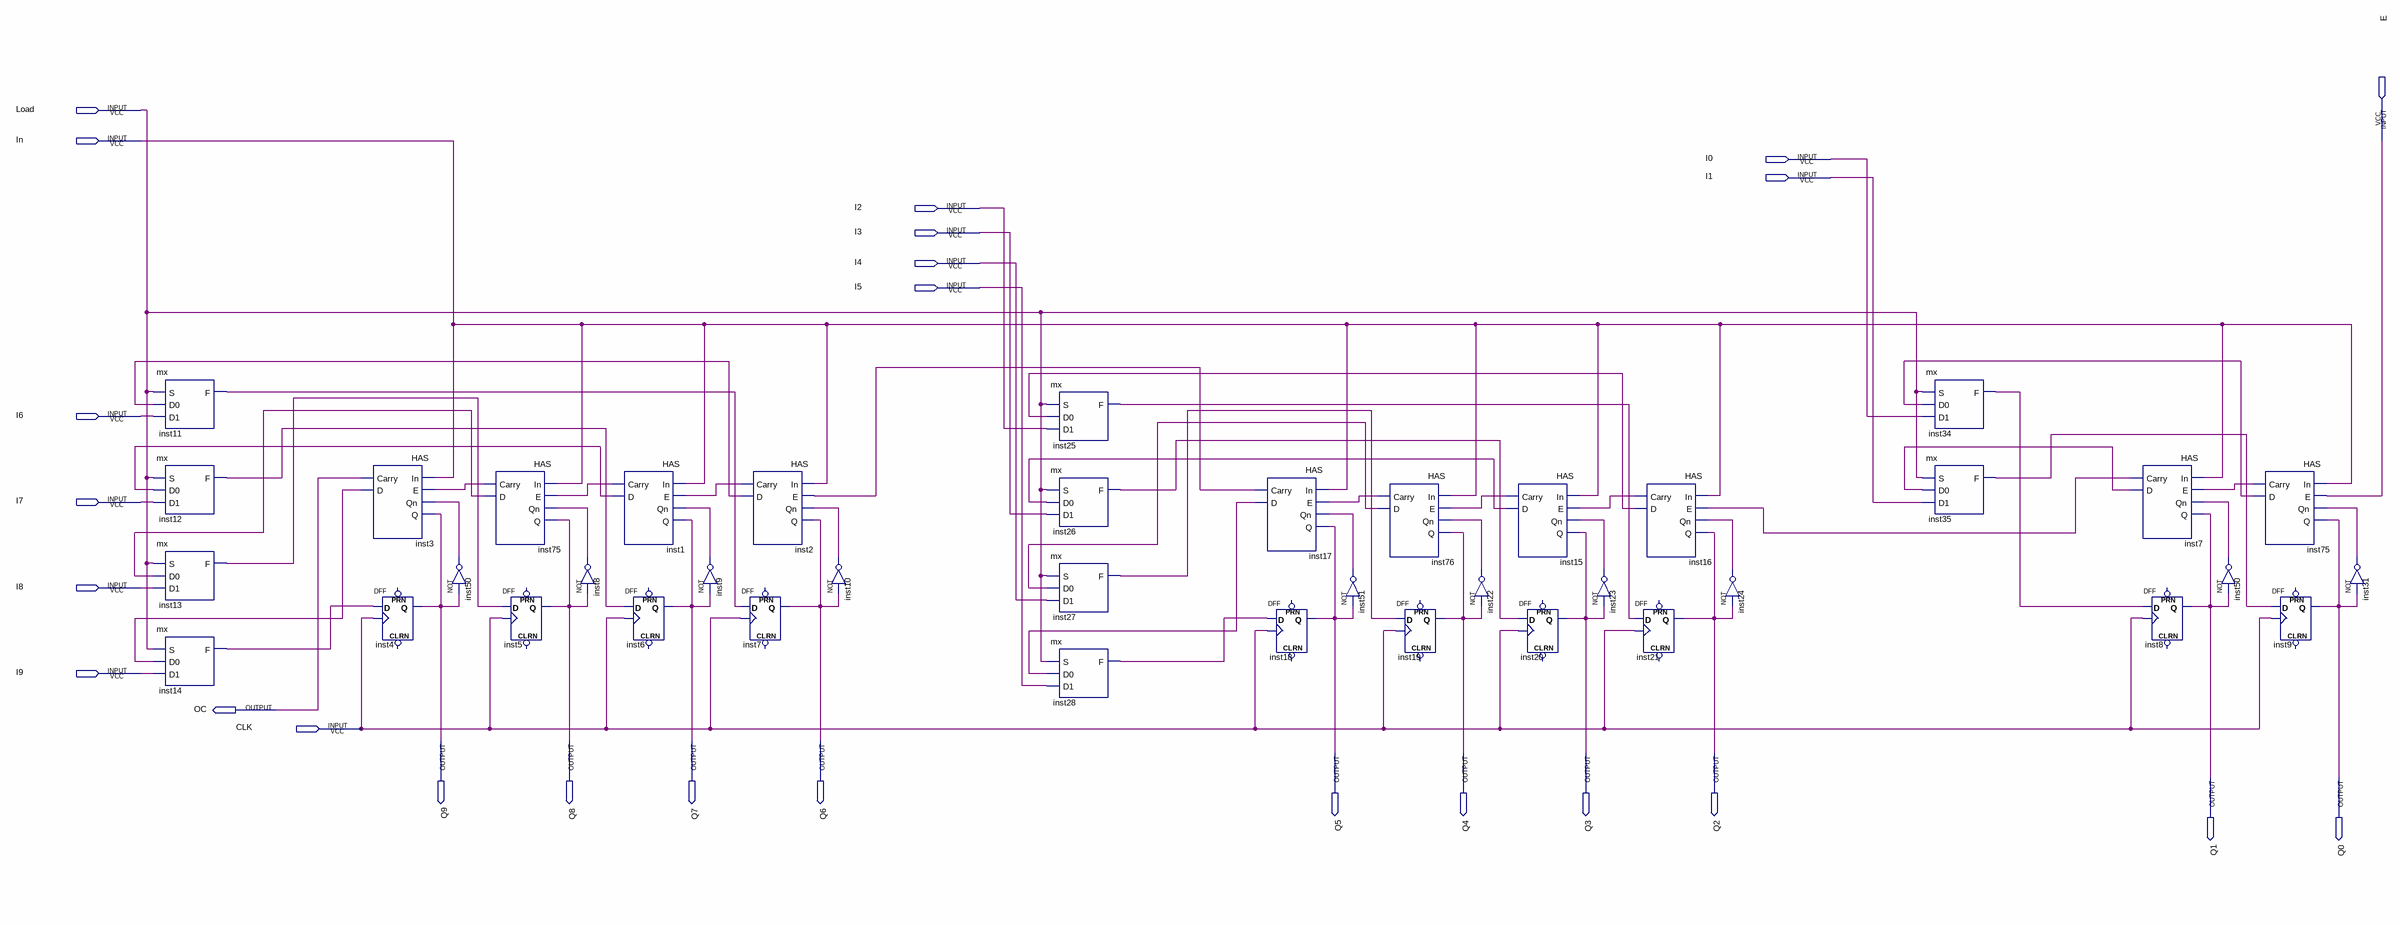
[diagram p0: schematic sheet]
// Quartus schematic Counter.bdf as structural Verilog: 40 symbols, 25 pins
module Counter (
  input  Load,
  input  In,
  input  E,
  input  I0,
  input  I1,
  input  I2,
  input  I3,
  input  I4,
  input  I5,
  input  I6,
  input  I7,
  input  I8,
  input  I9,
  input  CLK,
  output OC,
  output Q9,
  output Q8,
  output Q7,
  output Q6,
  output Q5,
  output Q4,
  output Q3,
  output Q2,
  output Q1,
  output Q0
);

  wire inst1_carry, inst1_d, inst2_carry, inst2_d, inst3_d, inst7_carry, inst7_d, inst8_out, inst9_out,
       inst10_out, inst11_f, inst12_f, inst13_f, inst14_f, inst15_carry, inst15_d, inst16_carry, inst16_d,
       inst17_carry, inst17_d, inst22_out, inst23_out, inst24_out, inst25_f, inst26_f, inst27_f, inst28_f,
       inst31_out, inst34_f, inst35_f, inst50_out, inst50_out_2, inst51_out, inst75_carry, inst75_carry_2,
       inst75_d, inst75_d_2, inst76_carry, inst76_d;

  mx inst11 (.S(Load), .D0(inst2_d), .D1(I6), .F(inst11_f));
  mx inst12 (.S(Load), .D0(inst1_d), .D1(I7), .F(inst12_f));
  mx inst13 (.S(Load), .D0(inst75_d), .D1(I8), .F(inst13_f));
  mx inst14 (.S(Load), .D0(inst3_d), .D1(I9), .F(inst14_f));
  HAS inst3 (.In(In), .E(inst75_carry), .Qn(inst50_out), .Q(Q9), .Carry(OC), .D(inst3_d));
  DFF inst4 (.CLK(CLK), .D(inst14_f), .Q(Q9));  // open: CLRN, PRN
  not inst50 (inst50_out, Q9);
  HAS inst75 (.In(In), .E(inst1_carry), .Qn(inst8_out), .Q(Q8), .Carry(inst75_carry), .D(inst75_d));
  DFF inst5 (.CLK(CLK), .D(inst13_f), .Q(Q8));  // open: CLRN, PRN
  not inst8 (inst8_out, Q8);
  HAS inst1 (.In(In), .E(inst2_carry), .Qn(inst9_out), .Q(Q7), .Carry(inst1_carry), .D(inst1_d));
  DFF inst6 (.CLK(CLK), .D(inst12_f), .Q(Q7));  // open: CLRN, PRN
  not inst9 (inst9_out, Q7);
  HAS inst2 (.In(In), .E(inst17_carry), .Qn(inst10_out), .Q(Q6), .Carry(inst2_carry), .D(inst2_d));
  DFF inst7 (.CLK(CLK), .D(inst11_f), .Q(Q6));  // open: CLRN, PRN
  not inst10 (inst10_out, Q6);
  mx inst25 (.S(Load), .D0(inst16_d), .D1(I2), .F(inst25_f));
  mx inst26 (.S(Load), .D0(inst15_d), .D1(I3), .F(inst26_f));
  mx inst27 (.S(Load), .D0(inst76_d), .D1(I4), .F(inst27_f));
  mx inst28 (.S(Load), .D0(inst17_d), .D1(I5), .F(inst28_f));
  HAS inst17 (.In(In), .E(inst76_carry), .Qn(inst51_out), .Q(Q5), .Carry(inst17_carry), .D(inst17_d));
  DFF inst18 (.CLK(CLK), .D(inst28_f), .Q(Q5));  // open: CLRN, PRN
  not inst51 (inst51_out, Q5);
  HAS inst76 (.In(In), .E(inst15_carry), .Qn(inst22_out), .Q(Q4), .Carry(inst76_carry), .D(inst76_d));
  DFF inst19 (.CLK(CLK), .D(inst27_f), .Q(Q4));  // open: CLRN, PRN
  HAS inst15 (.In(In), .E(inst16_carry), .Qn(inst23_out), .Q(Q3), .Carry(inst15_carry), .D(inst15_d));
  not inst22 (inst22_out, Q4);
  DFF inst20 (.CLK(CLK), .D(inst26_f), .Q(Q3));  // open: CLRN, PRN
  not inst23 (inst23_out, Q3);
  HAS inst16 (.In(In), .E(inst7_carry), .Qn(inst24_out), .Q(Q2), .Carry(inst16_carry), .D(inst16_d));
  DFF inst21 (.CLK(CLK), .D(inst25_f), .Q(Q2));  // open: CLRN, PRN
  not inst24 (inst24_out, Q2);
  mx inst34 (.S(Load), .D0(inst75_d_2), .D1(I0), .F(inst34_f));
  mx inst35 (.S(Load), .D0(inst7_d), .D1(I1), .F(inst35_f));
  HAS inst7_dup2 (.In(In), .E(inst75_carry_2), .Qn(inst50_out_2), .Q(Q1), .Carry(inst7_carry), .D(inst7_d));
  DFF inst8_dup2 (.CLK(CLK), .D(inst34_f), .Q(Q1));  // open: CLRN, PRN
  not inst50_dup2 (inst50_out_2, Q1);
  HAS inst75_dup2 (.In(In), .E(E), .Qn(inst31_out), .Q(Q0), .Carry(inst75_carry_2), .D(inst75_d_2));
  DFF inst9_dup2 (.CLK(CLK), .D(inst35_f), .Q(Q0));  // open: CLRN, PRN
  not inst31 (inst31_out, Q0);
endmodule
